# Altium schematic sheet MB1297_Arduino.SchDoc: Arduino Uno connector
size A4; DocumentNumber: MB1297; Revision: D; SheetNumber: 9; SheetTotal: 11
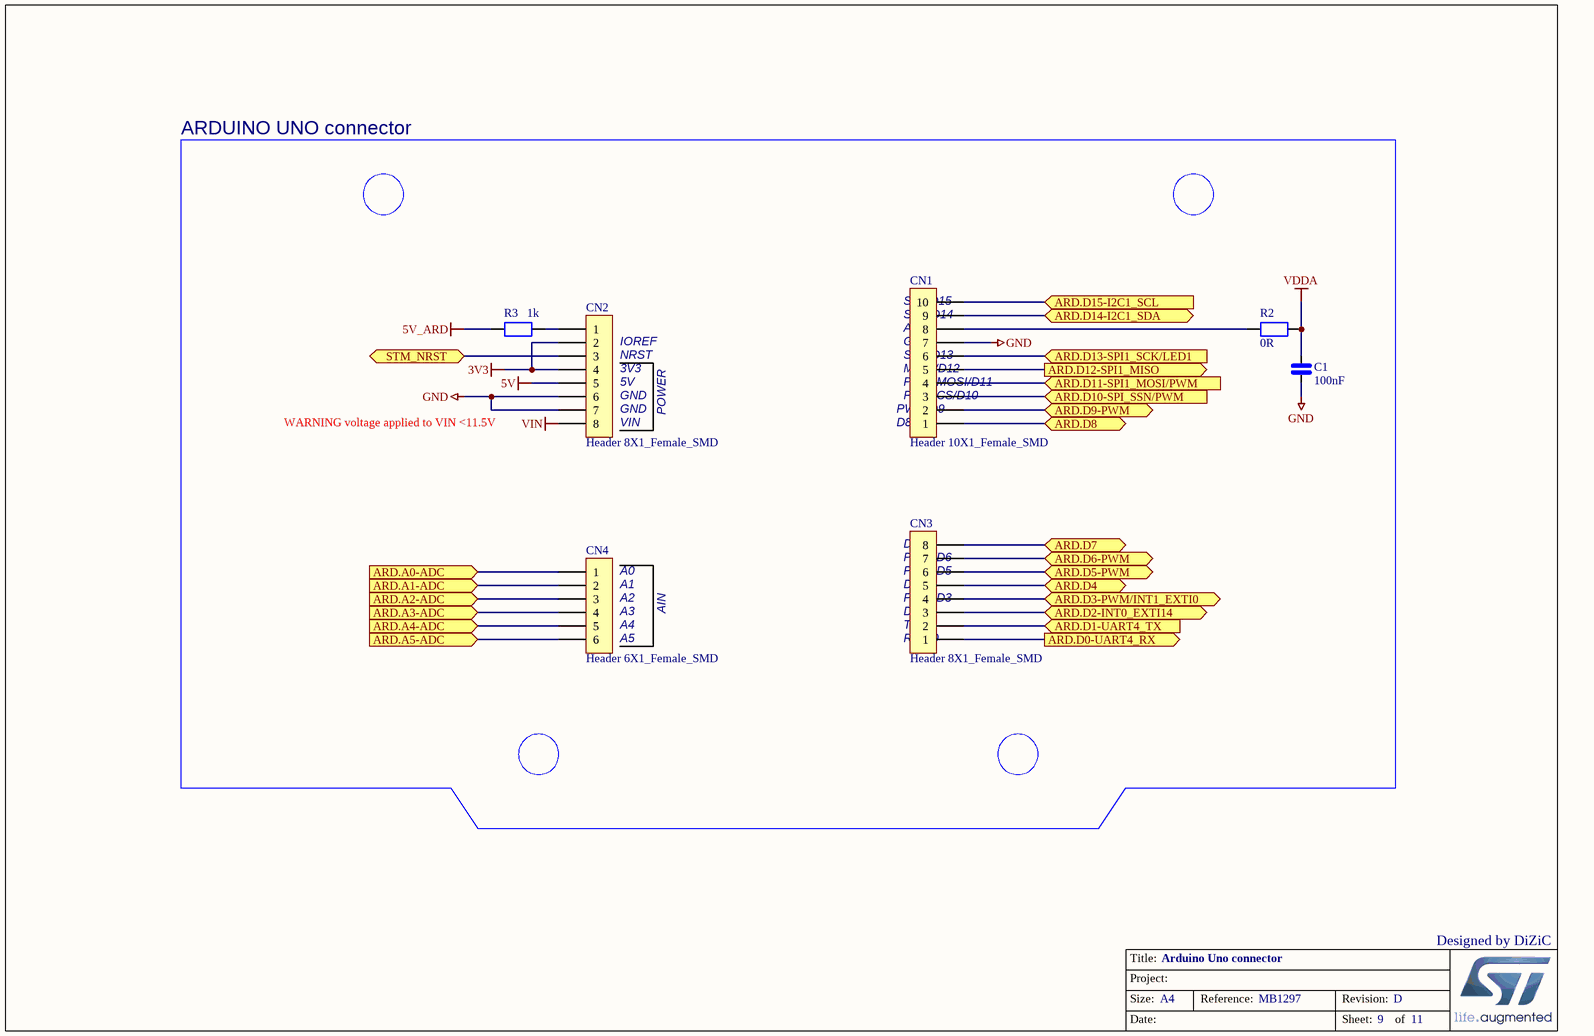
[diagram p0: MB1297_Arduino.SchDoc]

## Parts
C1  100nF  [0402_CAP_NPOL]
CN1  Header 10X1_Female_SMD  [F-V50XC-1X10R-LF]
CN2  Header 8X1_Female_SMD  [F-V50XC-1X08R-LF]
CN3  Header 8X1_Female_SMD  [F-V50XC-1X08R-LF]
CN4  Header 6X1_Female_SMD  [F-V50XC-1X06R-LF]
R2  0R  [0402_RES]
R3  1k  [0402_RES]

## Ports
ARD.A0-ADC, ARD.A1-ADC, ARD.A2-ADC, ARD.A3-ADC, ARD.A4-ADC, ARD.A5-ADC, ARD.D0-UART4_RX, ARD.D1-UART4_TX, ARD.D2-INT0_EXTI14, ARD.D3-PWM/INT1_EXTI0, ARD.D4, ARD.D5-PWM, ARD.D6-PWM, ARD.D7, ARD.D8, ARD.D9-PWM, ARD.D10-SPI_SSN/PWM, ARD.D11-SPI1_MOSI/PWM, ARD.D12-SPI1_MISO, ARD.D13-SPI1_SCK/LED1, ARD.D14-I2C1_SDA, ARD.D15-I2C1_SCL, STM_NRST

## Nets
3V3: CN2.2 CN2.4
5V: CN2.5
5V_ARD: R3.1
GND: C1.2 CN1.7 CN2.6 CN2.7
VDDA: C1.1 R2.2
VIN: CN2.8
ARD.A0-ADC: CN4.1 ; port ARD.A0-ADC
ARD.A1-ADC: CN4.2 ; port ARD.A1-ADC
ARD.A2-ADC: CN4.3 ; port ARD.A2-ADC
ARD.A3-ADC: CN4.4 ; port ARD.A3-ADC
ARD.A4-ADC: CN4.5 ; port ARD.A4-ADC
ARD.A5-ADC: CN4.6 ; port ARD.A5-ADC
ARD.D0-UART4_RX: CN3.1 ; port ARD.D0-UART4_RX
ARD.D1-UART4_TX: CN3.2 ; port ARD.D1-UART4_TX
ARD.D2-INT0_EXTI14: CN3.3 ; port ARD.D2-INT0_EXTI14
ARD.D3-PWM/INT1_EXTI0: CN3.4 ; port ARD.D3-PWM/INT1_EXTI0
ARD.D4: CN3.5 ; port ARD.D4
ARD.D5-PWM: CN3.6 ; port ARD.D5-PWM
ARD.D6-PWM: CN3.7 ; port ARD.D6-PWM
ARD.D7: CN3.8 ; port ARD.D7
ARD.D8: CN1.1 ; port ARD.D8
ARD.D9-PWM: CN1.2 ; port ARD.D9-PWM
ARD.D10-SPI_SSN/PWM: CN1.3 ; port ARD.D10-SPI_SSN/PWM
ARD.D11-SPI1_MOSI/PWM: CN1.4 ; port ARD.D11-SPI1_MOSI/PWM
ARD.D12-SPI1_MISO: CN1.5 ; port ARD.D12-SPI1_MISO
ARD.D13-SPI1_SCK/LED1: CN1.6 ; port ARD.D13-SPI1_SCK/LED1
ARD.D14-I2C1_SDA: CN1.9 ; port ARD.D14-I2C1_SDA
ARD.D15-I2C1_SCL: CN1.10 ; port ARD.D15-I2C1_SCL
STM_NRST: CN2.3 ; port STM_NRST
NetCN1_8: CN1.8 R2.1
NetCN2_1: CN2.1 R3.2

## Notes on the sheet
- ARDUINO UNO connector
- (near CN1) SCL/D15
- (near CN2) IOREF
- (near CN2) NRST
- (near CN2) 3V3
- (near CN2) 5V
- (near CN1) SDA/D14
- (near CN1) SCK/D13
- (near CN1) MISO/D12
- (near CN1) PWM/MOSI/D11
- (near CN1) AVDD
- (near CN1) GND
- WARNING voltage applied to VIN <11.5V
- (near CN2) GND
- (near CN2) VIN
- POWER
- (near CN1) D8
- (near CN1) PWM/D9
- (near CN1) PWM/CS/D10
- (near CN4) A0
- (near CN3) PWM/D5
- (near CN3) PWM/D6
- (near CN3) D7
- (near CN4) A1
- (near CN4) A2
- (near CN4) A3
- (near CN4) A4
- (near CN4) A5
- AIN
- (near CN3) RX/D0
- (near CN3) TX/D1
- (near CN3) D2
- (near CN3) D4
- (near CN3) PWM/D3
- Designed by DiZiC
- Title:
- Project:
- Size:
- Date:
- Reference:
- Sheet:
- Revision:
- of

## Library data of the parts
C1 = CAP_NPOL: Capacitor_not polarized
CN1 = Header 10X1_Female_SMD: Header, 10-Pin, SMD, Single row,female; LatestRevisionDate: 17-Jul-2002; LatestRevisionNote: Re-released for DXP Platform.; Publisher: Altium Limited
CN2 CN3 = Header 8X1_Female_SMD: Header, 8-Pin, SMD, Single row,female; LatestRevisionDate: 17-Jul-2002; LatestRevisionNote: Re-released for DXP Platform.; Publisher: Altium Limited
CN4 = Header 6X1_Female_SMD: Header, 6-Pin, SMD, Single row,female; LatestRevisionDate: 17-Jul-2002; LatestRevisionNote: Re-released for DXP Platform.; Publisher: Altium Limited
R2 R3 = RES: Resistor